# EAGLE design FM_module_TEA5767 (EAGLE 7.6.0)
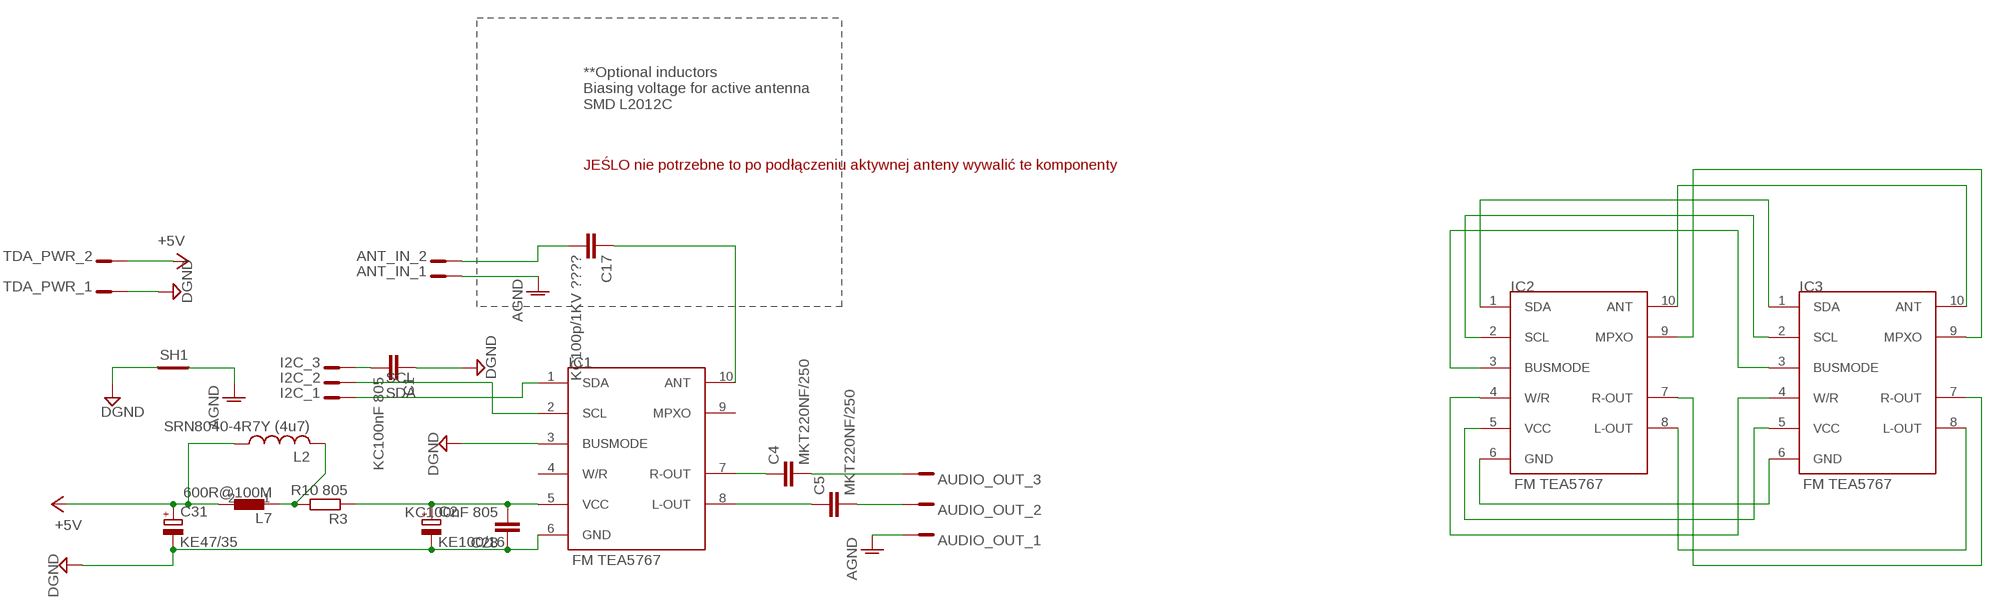
[diagram p0: schematic, sheet 1]

## Parts
ANT_IN  JST_2_PIN_B2B-PH-KS  [B2B-PH-KS]
AUDIO_OUT  JST_3_PIN_B3B-PH-KS  [B3B-PH-KS]
C1  KC100nF 805  C-EUC0805  [C0805]
C2  KE100/16  CPOL-EUTT2D6  [TT2D6]
C4  MKT220NF/250  C-EU050-050X075  [C050-050X075]
C5  MKT220NF/250  C-EU050-050X075  [C050-050X075]
C17  KC100p/1KV ????  C-EU050-025X075  [C050-025X075]
C28  KC100nF 805  C-EUC0805  [C0805]
C31  KE47/35  CPOL-EUTT2D6  [TT2D6]
I2C  JST_3_PIN_B3B-PH-KS  [B3B-PH-KS]
IC1  FM TEA5767  TEA5767_MODULE_2.54MM  [PROTOTYPE]
IC2  FM TEA5767  TEA5767_MODULE_2.54MM  [PROTOTYPE]
IC3  FM TEA5767  TEA5767_MODULE_SMD  [SMD]
L2  SRN8040-4R7Y (4u7)  L-US0204/5  [0204/5]
L7  600R@100M  FERRITR0805  [R0805]
R3  R10 805  R-EU_R0805  [R0805]
SH1  SHORT-HT5  [SHORT_TOP-50]
TDA_PWR  JST_2_PIN_B2B-XH-A  [B2B-XH-A]

## Nets
+5V: C31.+ L2.1 L7.2 TDA_PWR.P$2
AGND: ANT_IN.P$1 AUDIO_OUT.P$1 SH1.2
DGND: C1.1 C2.- C28.1 C31.- IC1.3(BUSMODE) IC1.6(GND) SH1.1 TDA_PWR.P$1
N$1: ANT_IN.P$2 C17.2
N$2: IC2.1(SDA) IC3.1(SDA)
N$4: C2.+ C28.2 IC1.5(VCC) R3.1
N$6: C17.1 IC1.10(ANT)
N$7: IC2.2(SCL) IC3.2(SCL)
N$8: C4.1 IC1.7(R-OUT)
N$9: C5.1 IC1.8(L-OUT)
N$10: IC2.3(BUSMODE) IC3.3(BUSMODE)
N$11: IC2.10(ANT) IC3.10(ANT)
N$12: IC2.9(MPXO) IC3.9(MPXO)
N$13: IC2.6(GND) IC3.6(GND)
N$14: IC2.5(VCC) IC3.5(VCC)
N$15: IC2.4(W/R) IC3.4(W/R)
N$16: L2.2 L7.1 R3.2
N$17: IC2.8(L-OUT) IC3.8(L-OUT)
N$18: IC2.7(R-OUT) IC3.7(R-OUT)
N$28: AUDIO_OUT.P$3 C4.2
N$29: AUDIO_OUT.P$2 C5.2
N$30: C1.2 I2C.P$3
SCL: I2C.P$2 IC1.2(SCL)
SDA: I2C.P$1 IC1.1(SDA)
Unconnected: IC1.4(W/R) IC1.9(MPXO)

## Notes on the sheet
- **Optional inductors
  Biasing voltage for active antenna
  SMD L2012C
- JEŚLO nie potrzebne to po podłączeniu aktywnej anteny wywalić te komponenty

## Library data of the parts
ANT_IN TDA_PWR = conn-JST:JST_2_PIN_
AUDIO_OUT I2C = conn-JST:JST_3_PIN_
C1 C4 C5 C17 C28 = rcl:C-EU: CAPACITOR, European symbol
C2 C31 = rcl:CPOL-EU: POLARIZED CAPACITOR, European symbol
IC1-IC3 = TEA5767_module:TEA5767_MODULE_
L2 = rcl:L-US: INDUCTOR, American symbol
L7 = ferrit_bear:FERRIT
R3 = rcl:R-EU_: RESISTOR, European symbol
SH1 = shorts-old:SHORT-H: Short between two nets; BOM: no

## Board
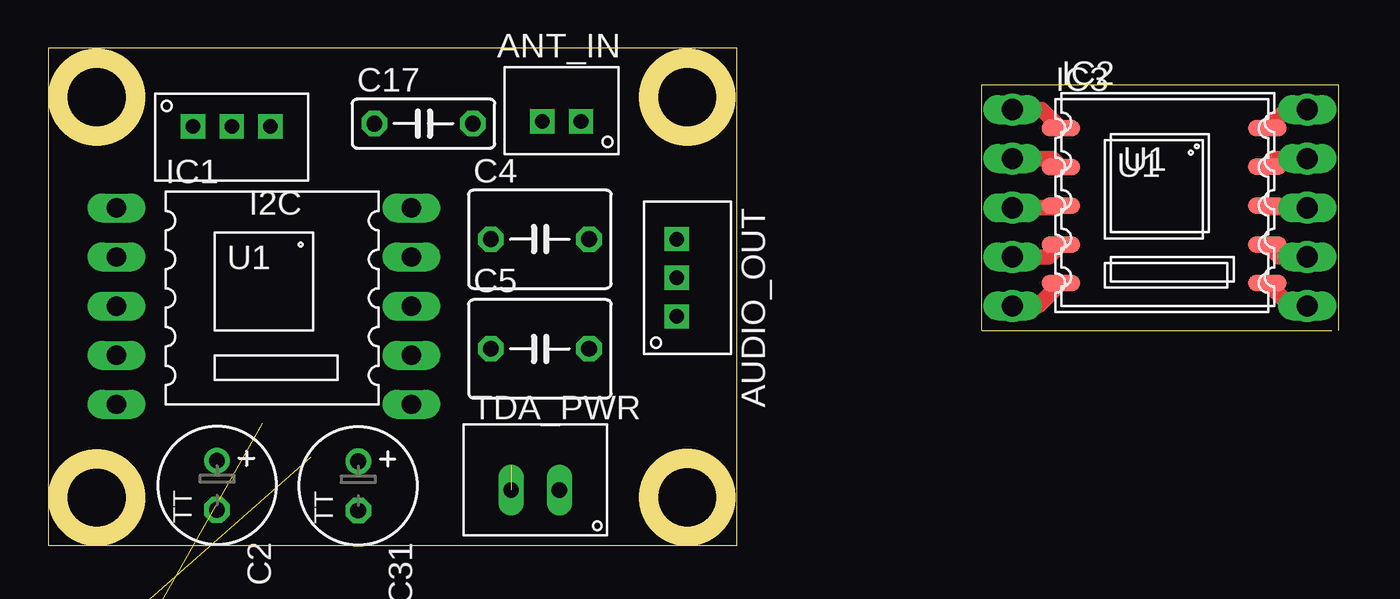
[diagram p1: board, top side]
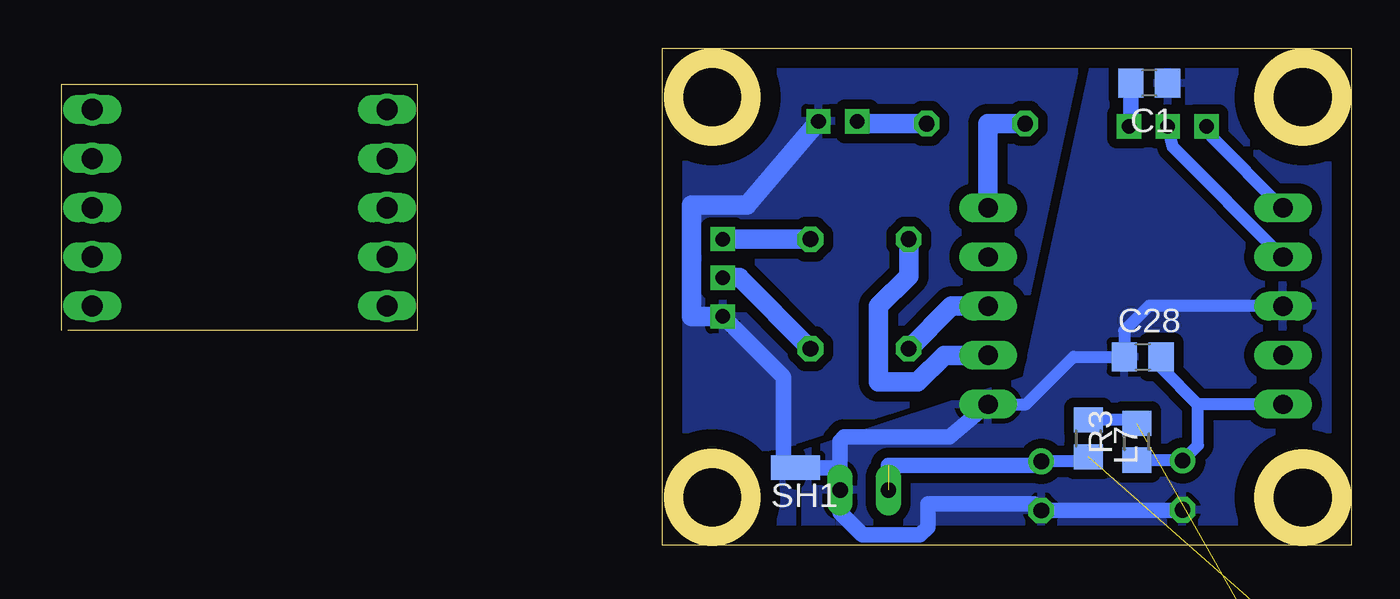
[diagram p2: board, bottom side, seen from below]

Size 66.65 x 25.7 mm. Coordinates in mm from the lower left corner, seen from the top.
Outline: 66.65,11.11 66.65,23.82 48.24,23.82 48.24,11.11 66.33,11.11
Outline: 0,0 35.58,0 35.58,25.7 0,25.7 0,0
Outline: circle at 33.01,23.18 radius 2
Outline: circle at 33.02,2.49 radius 2
Outline: circle at 2.49,23.17 radius 2
Outline: circle at 2.5,2.47 radius 2
Copper layers (1*16): Top 0.035mm / dielectric 1.5mm / Bottom 0.035mm
Design rules "default": minimum track width 10mil, minimum drill 24mil, track to track 8mil, track to pad 8mil, pad to pad 8mil, via to via 8mil, smd to smd 8mil, copper to edge 40mil, drill to drill 8mil, minimum pad ring 10mil, minimum via ring 8mil, stop-mask expansion 4mil, vias tented up to drill 0mil, thermal gap 10mil

### Footprints (pad centres in the part's own frame; a part is rotated, then mirrored left to right if it is on the bottom)
B2B-PH-KS = drill 0.75 pad 1.2 square: P$1 -2,1.7; P$2 -4,1.7
B3B-PH-KS = drill 0.75 pad 1.2 square: P$1 -2,1.7; P$2 -4,1.7; P$3 -6,1.7
C0805 = smd 1.3 x 1.5: 1 -0.95,0; 2 0.95,0
TT2D6 = drill 0.813: + -1.27,0 | drill 0.813 octagon: - 1.27,0
C050-050X075 = drill 0.813 octagon: 1 -2.54,0; 2 2.54,0
C050-025X075 = drill 0.813 octagon: 1 -2.54,0; 2 2.54,0
PROTOTYPE = drill 1 pad 1.27 long: 1 -7.62,3.81; 2 -7.62,1.27; 3 -7.62,-1.27; 4 -7.62,-3.81; 5 -7.62,-6.35; 6 7.62,-6.35; 7 7.62,-3.81; 8 7.62,-1.27; 9 7.62,1.27; 10 7.62,3.81
SMD = smd 2 x 0.85: 1 -4.8,3.15; 2 -4.8,1.15; 3 -4.8,-0.85; 4 -4.8,-2.85; 5 -4.8,-4.85; 6 5.866,-4.85; 7 5.866,-2.85; 8 5.866,-0.85; 9 5.866,1.16; 10 5.866,3.15
0204/5 = drill 0.813 octagon: 1 -2.54,0; 2 2.54,0
R0805 = smd 1.3 x 1.5: 1 -0.95,0; 2 0.95,0
SHORT_TOP-50 = smd 1.27 x 1.27: 1 0.635,0; 2 -0.635,0
B2B-XH-A = drill 0.8 long: P$1 -2.45,2.35; P$2 -4.95,2.35

### Placement (x,y rotation side)
ANT_IN  29.53,20.23 0 top
AUDIO_OUT  30.77,9.84 270 top
C1  10.43,23.91 180 bottom
C2  8.71,3.11 270 top
C4  25.4,15.84 0 top
C5  25.4,10.17 0 top
C17  19.39,21.81 0 top
C28  10.77,9.75 0 bottom
C31  16.01,3.08 270 top
I2C  5.48,23.37 180 top
IC1  11.14,13.64 0 top
IC2  57.44,18.73 0 top
IC3  57.13,18.41 0 top
L2  -0.98,-10.48 0 top  (outside the outline)
L7  13.58,5.54 270 bottom
R3  11.08,5.36 90 bottom
SH1  28.71,4.02 0 bottom
TDA_PWR  28.86,0.52 0 top

### Tracks (layer width: path | path; a pad name or v marks a point on that pad's centre or on a via)
+5V  (2 unrouted)
  Bottom 0.61: L7.2 13.82,4.35 C31.+
  Bottom 0.813: C31.+ 16.2,4.15 23.91,4.15
AGND
  Bottom 0.813: SH1.2 29.35,8.72 AUDIO_OUT.P$1
  Bottom 1.016: AUDIO_OUT.P$1 34.09,11.84 34.09,17.6 31.22,17.6 ANT_IN.P$1
  pour Bottom (isolate 0.508): 13.88,26.39 38.73,26.39 39.04,-1.44 28.88,-1.44 28.88,5.41 20.61,8.03 20.53,8.76 17.67,8.76
DGND
  Bottom 0.61: IC1.3 10.45,12.38 11.72,11.11 C28.1 14.35,9.75 16.8,7.3 IC1.6
  Bottom 0.813: C2.- 8.71,1.81 C31.- 16.36,2.15 21.88,2.15 21.88,0.95 22.28,0.55 25.25,0.55 26.41,1.71 TDA_PWR.P$1 26.41,3.49 | IC1.6 20.76,5.6 26.2,5.6 26.41,5.39 26.41,3.49 | SH1.1 26.94,4.02 arc90 26.41,3.49
  pour Bottom (isolate 0.508): -3.52,26.35 12.99,26.35 16.8,8.55 28.23,4.76 28.23,-1.59 -3.52,-1.59
N$1
  Bottom 1.016: C17.2 25.53,21.81 ANT_IN.P$2
N$2
  Top 0.813: IC2.1 51.35,22.54 IC3.1
N$4
  Bottom 0.61: IC1.5 7.91,7.3 | 7.91,7.3 9.82,9.21 C28.2 | 7.91,7.3 7.91,5.18 C2.+ 8.74,4.41 R3.1
N$5  (via drill 1.1)
  other vias: 49.82,20
N$6
  Bottom 1.016: C17.1 18.76,21.81 IC1.10
N$7
  Top 0.813: IC2.2 51.89,20 IC3.2
N$8
  Bottom 1.016: C4.1 22.86,13.94 24.42,12.38 24.42,8.45 22.41,8.45 21.02,9.83 IC1.7
N$9
  Bottom 1.016: IC1.8 20.65,12.37 C5.1
N$10
  Top 0.813: IC2.3 52.22,17.46 IC3.3
N$11
  Top 0.813: IC2.10 63.97,22.54 IC3.10
N$12
  Top 0.813: IC2.9 63.42,20 IC3.9
N$13
  Top 0.813: IC2.6 64.18,12.38 IC3.6
N$14
  Top 0.813: IC2.5 51.14,12.38 IC3.5
N$15
  Top 0.813: IC2.4 51.68,14.92 IC3.4
N$16  (1 unrouted)
  Bottom 0.61: R3.2 11.25,6.49 L7.1
N$17
  Top 0.813: IC2.8 63.1,17.46 IC3.8
N$18
  Top 0.813: IC2.7 63.64,14.92 IC3.7
N$19  (via drill 1.1)
  other vias: 49.82,22.54
N$20  (via drill 1.1)
  other vias: 49.82,17.46
N$21  (via drill 1.1)
  other vias: 49.82,14.92
N$22  (via drill 1.1)
  other vias: 49.82,12.38
N$23  (via drill 1.1)
  other vias: 65.06,22.54
N$24  (via drill 1.1)
  other vias: 65.06,20
N$25  (via drill 1.1)
  other vias: 65.06,17.46
N$26  (via drill 1.1)
  other vias: 65.06,14.92
N$27  (via drill 1.1)
  other vias: 65.06,12.38
N$28
  Bottom 1.016: C4.2 AUDIO_OUT.P$3
N$29
  Bottom 1.016: C5.2 31.61,13.84 AUDIO_OUT.P$2
N$30
  Bottom 0.813: I2C.P$3 11.38,21.56 C1.2
SCL
  Bottom 0.61: IC1.2 9.22,20.61 I2C.P$2
SDA
  Bottom 0.61: IC1.1 7.22,21.15 I2C.P$1

### Text on the board
Document: SDA / SLC / GND